# Altium project MicroMultimeter.PrjPCB
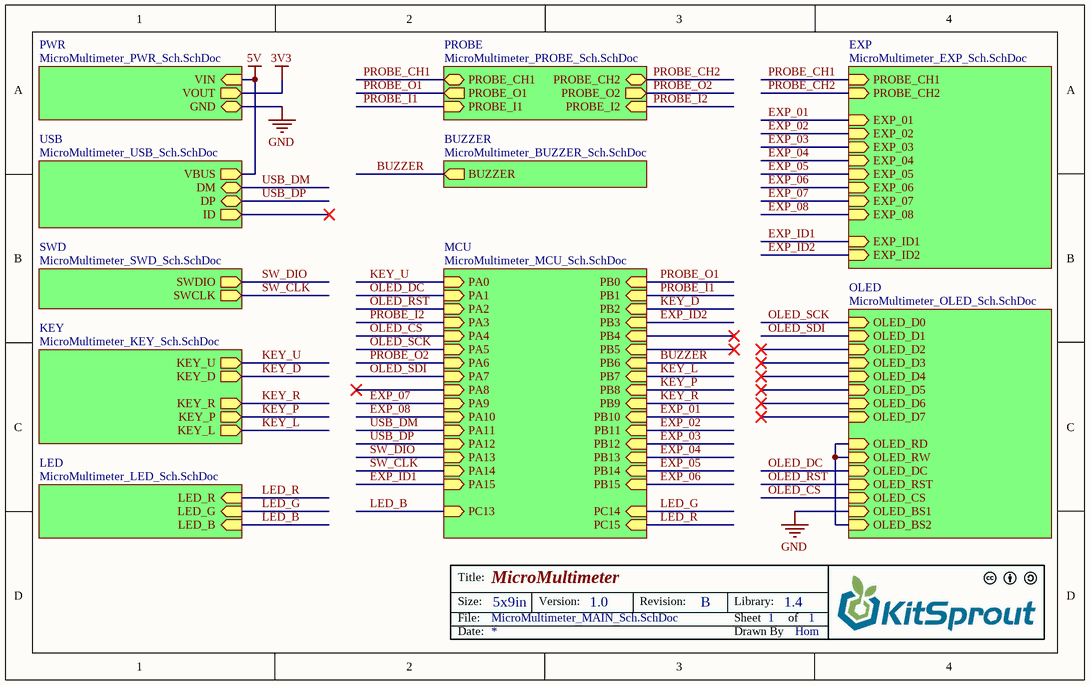
[diagram p0: MicroMultimeter_MAIN_Sch.SchDoc]
11 sheets, 58 parts. Net scope: hierarchical (ports join the sheet entries above them; power ports are global).
Board file: MicroMultimeter__Pcb.PcbDoc
Sheets:
  MicroMultimeter_MAIN_Sch.SchDoc
    PWR = MicroMultimeter_PWR_Sch.SchDoc
    SWD = MicroMultimeter_SWD_Sch.SchDoc
    KEY = MicroMultimeter_KEY_Sch.SchDoc
    USB = MicroMultimeter_USB_Sch.SchDoc
    LED = MicroMultimeter_LED_Sch.SchDoc
    PROBE = MicroMultimeter_PROBE_Sch.SchDoc
    BUZZER = MicroMultimeter_BUZZER_Sch.SchDoc
    OLED = MicroMultimeter_OLED_Sch.SchDoc
    EXP = MicroMultimeter_EXP_Sch.SchDoc
    MCU = MicroMultimeter_MCU_Sch.SchDoc

## Sheet MicroMultimeter_MAIN_Sch.SchDoc: MicroMultimeter
size 203 x 127 mm; Author: Hom; CompanyName: KitSprout; DrawnBy: Hom; Engineer: Hom; Organization: KitSprout; Revision: B; SheetNumber: 1; SheetTotal: 1; License: CC BY-SA 4.0; Version: 1.0; LibVersion: 1.4; PageSetup: Record=PageOptions|CenterHorizontal=True|CenterVertical=True|PrintScale=1.00|XCorrection=1.00|YCorrection=1.00|PrintKind=0|BorderSize=5000000|LeftOffset=0|BottomOffset=0|Orientation=2|PaperLength=1000|PaperWidth=1000|Scale=100|PaperSource=7|PrintQuality=-3|MediaType=1|DitherType=10|PrintScaleMode=0|PaperKind=A4|PaperIndex=9

### Sub-sheets
BUZZER = MicroMultimeter_BUZZER_Sch.SchDoc: BUZZER (out)
EXP = MicroMultimeter_EXP_Sch.SchDoc: PROBE_CH1 (in), PROBE_CH2 (in), EXP_01 (in), EXP_02 (in), EXP_03 (in), EXP_04 (in), EXP_05 (in), EXP_06 (in), EXP_07 (in), EXP_08 (in), EXP_ID1 (in), EXP_ID2 (in)
KEY = MicroMultimeter_KEY_Sch.SchDoc: KEY_D (out), KEY_U (out), KEY_P (out), KEY_R (out), KEY_L (out)
LED = MicroMultimeter_LED_Sch.SchDoc: LED_G (in), LED_R (in), LED_B (in)
MCU = MicroMultimeter_MCU_Sch.SchDoc: PA0 (in), PA1 (in), PA2 (in), PA3 (in), PA4 (in), PA5 (in), PA6 (in), PA7 (in), PA8 (in), PA9 (in), PA10 (in), PA11 (in), PA12 (in), PA13 (in), PA14 (in), PA15 (in), PB0 (in), PB1 (in), PB2 (in), PB3 (in), PB4 (in), PB5 (in), PB6 (in), PB7 (in), PB8 (in), PB9 (in), PB10 (in), PB11 (in), PB12 (in), PB13 (in), PB14 (in), PB15 (in), PC13 (in), PC14 (in), PC15 (in)
OLED = MicroMultimeter_OLED_Sch.SchDoc: OLED_D0 (in), OLED_D1 (in), OLED_D2 (in), OLED_D3 (in), OLED_D4 (in), OLED_D5 (in), OLED_D6 (in), OLED_D7 (in), OLED_RD (in), OLED_RW (in), OLED_DC (in), OLED_RST (in), OLED_CS (in), OLED_BS1 (in), OLED_BS2 (in)
PROBE = MicroMultimeter_PROBE_Sch.SchDoc: PROBE_CH2 (bidir), PROBE_CH1 (bidir), PROBE_I1 (in), PROBE_I2 (in), PROBE_O1 (out), PROBE_O2 (out)
PWR = MicroMultimeter_PWR_Sch.SchDoc: VOUT (out), VIN (in), GND (bidir)
SWD = MicroMultimeter_SWD_Sch.SchDoc: SWDIO (out), SWCLK (out)
USB = MicroMultimeter_USB_Sch.SchDoc: DM (bidir), VBUS (out), DP (bidir), ID (out)

### Nets
5V: sheet PWR/VIN, sheet USB/VBUS
GND: sheet PWR/GND, sheet OLED/OLED_BS1
BUZZER: sheet BUZZER/BUZZER, sheet MCU/PB6
EXP_01: sheet EXP/EXP_01, sheet MCU/PB10
EXP_02: sheet EXP/EXP_02, sheet MCU/PB11
EXP_03: sheet EXP/EXP_03, sheet MCU/PB12
EXP_04: sheet EXP/EXP_04, sheet MCU/PB13
EXP_05: sheet EXP/EXP_05, sheet MCU/PB14
EXP_06: sheet EXP/EXP_06, sheet MCU/PB15
EXP_07: sheet EXP/EXP_07, sheet MCU/PA9
EXP_08: sheet EXP/EXP_08, sheet MCU/PA10
EXP_ID1: sheet EXP/EXP_ID1, sheet MCU/PA15
EXP_ID2: sheet EXP/EXP_ID2, sheet MCU/PB3
KEY_D: sheet KEY/KEY_D, sheet MCU/PB2
KEY_L: sheet KEY/KEY_L, sheet MCU/PB7
KEY_P: sheet KEY/KEY_P, sheet MCU/PB8
KEY_R: sheet KEY/KEY_R, sheet MCU/PB9
KEY_U: sheet KEY/KEY_U, sheet MCU/PA0
LED_B: sheet LED/LED_B, sheet MCU/PC13
LED_G: sheet LED/LED_G, sheet MCU/PC14
LED_R: sheet LED/LED_R, sheet MCU/PC15
OLED_CS: sheet OLED/OLED_CS, sheet MCU/PA4
OLED_DC: sheet OLED/OLED_DC, sheet MCU/PA1
OLED_RST: sheet OLED/OLED_RST, sheet MCU/PA2
OLED_SCK: sheet OLED/OLED_D0, sheet MCU/PA5
OLED_SDI: sheet OLED/OLED_D1, sheet MCU/PA7
PROBE_CH1: sheet PROBE/PROBE_CH1, sheet EXP/PROBE_CH1
PROBE_CH2: sheet PROBE/PROBE_CH2, sheet EXP/PROBE_CH2
PROBE_I1: sheet PROBE/PROBE_I1, sheet MCU/PB1
PROBE_I2: sheet PROBE/PROBE_I2, sheet MCU/PA3
PROBE_O1: sheet PROBE/PROBE_O1, sheet MCU/PB0
PROBE_O2: sheet PROBE/PROBE_O2, sheet MCU/PA6
SW_CLK: sheet SWD/SWCLK, sheet MCU/PA14
SW_DIO: sheet SWD/SWDIO, sheet MCU/PA13
USB_DM: sheet USB/DM, sheet MCU/PA11
USB_DP: sheet USB/DP, sheet MCU/PA12
NetOLED_0.96_11: sheet OLED/OLED_RD, sheet OLED/OLED_RW, sheet OLED/OLED_BS2

### Notes on the sheet
- Title:
- Size:
- Date:
- File:
- 5x9in
- Version:
- Revision:
- Sheet
- Drawn By
- Library:
- of

## Sheet MicroMultimeter_PWR_Sch.SchDoc: MicroMultimeter - PWR
size 127 x 101 mm; Author: Hom; CompanyName: KitSprout; DrawnBy: Hom; Engineer: Hom; Organization: KitSprout; Revision: A; SheetNumber: 1; SheetTotal: 1; License: CC BY-SA 4.0; Version: 1.0; LibVersion: 1.4; PageSetup: Record=PageOptions|CenterHorizontal=True|CenterVertical=True|PrintScale=1.00|XCorrection=1.00|YCorrection=1.00|PrintKind=0|BorderSize=5000000|LeftOffset=0|BottomOffset=0|Orientation=2|PaperLength=1000|PaperWidth=1000|Scale=100|PaperSource=7|PrintQuality=-3|MediaType=1|DitherType=10|PrintScaleMode=0|PaperKind=A4|PaperIndex=9
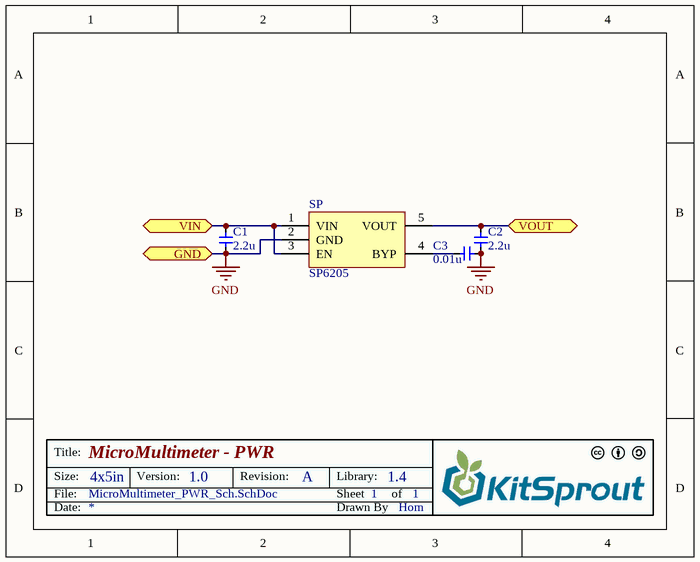
[diagram p1: MicroMultimeter_PWR_Sch.SchDoc]

### Parts
C1  value 2.2u  [CAP_0603]  (hidden comment: Cap_0603)
C2  value 2.2u  [CAP_0603]  (hidden comment: Cap_0603)
C3  value 0.01u  [CAP_0603]  (hidden comment: Cap_0603)
SP  SP6205  [SOT23-5]

### Ports
GND, VIN, VOUT

### Nets
3V3: C2.2 SP.5(VOUT) ; port VOUT
5V: C1.2 SP.1(VIN) SP.3(EN) ; port VIN
GND: C1.1 C2.1 C3.1 SP.2(GND) ; port GND
NetC3_2: C3.2 SP.4(BYP)

### Notes on the sheet
- Title:
- Size:
- Date:
- File:
- 4x5in
- Version:
- Revision:
- Sheet
- Drawn By
- Library:
- of

### Library data of the parts
C1-C3 = Cap_0603: Capacitor
SP = SP6205: Power

## Sheet MicroMultimeter_SWD_Sch.SchDoc: MicroMultimeter - SWD
size 127 x 101 mm; Author: Hom; CompanyName: KitSprout; DrawnBy: Hom; Engineer: Hom; Organization: KitSprout; Revision: A; SheetNumber: 1; SheetTotal: 1; License: CC BY-SA 4.0; Version: 1.0; LibVersion: 1.4; PageSetup: Record=PageOptions|CenterHorizontal=True|CenterVertical=True|PrintScale=1.00|XCorrection=1.00|YCorrection=1.00|PrintKind=0|BorderSize=5000000|LeftOffset=0|BottomOffset=0|Orientation=2|PaperLength=1000|PaperWidth=1000|Scale=100|PaperSource=7|PrintQuality=-3|MediaType=1|DitherType=10|PrintScaleMode=0|PaperKind=A4|PaperIndex=9
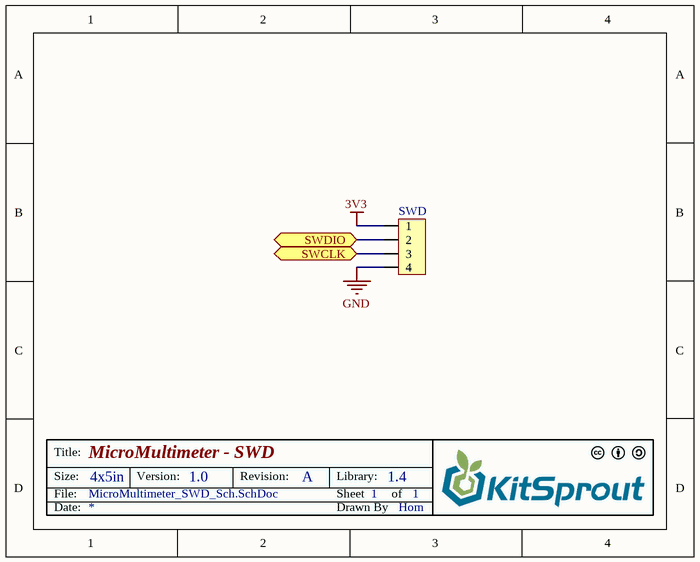
[diagram p2: MicroMultimeter_SWD_Sch.SchDoc]

### Parts
SWD  HDR1x4_1.27  [HDR1X4_1.27_180]  (value not drawn)

### Ports
SWCLK, SWDIO

### Nets
3V3: SWD.1
GND: SWD.4
SW_CLK: SWD.3 ; port SWCLK
SW_DIO: SWD.2 ; port SWDIO

### Notes on the sheet
- Title:
- Size:
- Date:
- File:
- 4x5in
- Version:
- Revision:
- Sheet
- Drawn By
- Library:
- of

### Library data of the parts
SWD = HDR1x4_1.27: Header

## Sheet MicroMultimeter_KEY_Sch.SchDoc: MicroMultimeter - KEY
size 127 x 101 mm; Author: Hom; CompanyName: KitSprout; DrawnBy: Hom; Engineer: Hom; Organization: KitSprout; Revision: A; SheetNumber: 1; SheetTotal: 1; License: CC BY-SA 4.0; Version: 1.0; LibVersion: 1.4; PageSetup: Record=PageOptions|CenterHorizontal=True|CenterVertical=True|PrintScale=1.00|XCorrection=1.00|YCorrection=1.00|PrintKind=0|BorderSize=5000000|LeftOffset=0|BottomOffset=0|Orientation=2|PaperLength=1000|PaperWidth=1000|Scale=100|PaperSource=7|PrintQuality=-3|MediaType=1|DitherType=10|PrintScaleMode=0|PaperKind=A4|PaperIndex=9
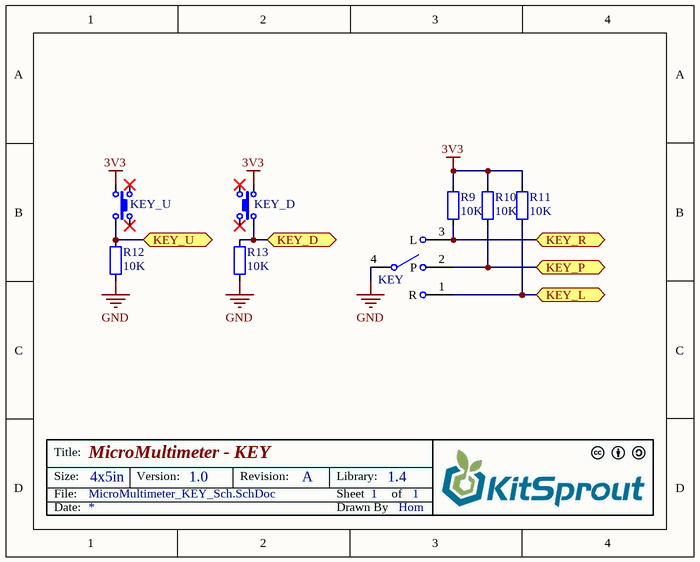
[diagram p3: MicroMultimeter_KEY_Sch.SchDoc]

### Parts
KEY  ButtonPushLever_11*12_90  [ButtonPushLever_11*12_90]  (value not drawn)
KEY_D  ButtonTACT  [ButtonTACT_3.5*3.55_90]  (value not drawn)
KEY_U  ButtonTACT  [ButtonTACT_3.5*3.55_90]  (value not drawn)
R9  value 10K  [RES_0603]  (hidden comment: Res_0603)
R10  value 10K  [RES_0603]  (hidden comment: Res_0603)
R11  value 10K  [RES_0603]  (hidden comment: Res_0603)
R12  value 10K  [RES_0603]  (hidden comment: Res_0603)
R13  value 10K  [RES_0603]  (hidden comment: Res_0603)

### Ports
KEY_D, KEY_L, KEY_P, KEY_R, KEY_U

### Nets
3V3: KEY_D.4 KEY_U.3 R9.2 R10.2 R11.2
GND: KEY.4 R12.1 R13.1
KEY_D: KEY_D.3 R13.2 ; port KEY_D
KEY_L: KEY.1(R) R11.1 ; port KEY_L
KEY_P: KEY.2(P) R10.1 ; port KEY_P
KEY_R: KEY.3(L) R9.1 ; port KEY_R
KEY_U: KEY_U.4 R12.2 ; port KEY_U

Not connected (* = marked no-connect by the designer): KEY_D 1* 2*; KEY_U 1* 2*

### Notes on the sheet
- Title:
- Size:
- Date:
- File:
- 4x5in
- Version:
- Revision:
- Sheet
- Drawn By
- Library:
- of

### Library data of the parts
KEY = ButtonPushLever_11*12_90: Button
KEY_D KEY_U = ButtonTACT: Button
R9-R13 = Res_0603: Resistor

## Sheet MicroMultimeter_USB_Sch.SchDoc: MicroMultimeter - USB
size 127 x 101 mm; Author: Hom; CompanyName: KitSprout; DrawnBy: Hom; Engineer: Hom; Organization: KitSprout; Revision: A; SheetNumber: 1; SheetTotal: 1; License: CC BY-SA 4.0; Version: 1.0; LibVersion: 1.4; PageSetup: Record=PageOptions|CenterHorizontal=True|CenterVertical=True|PrintScale=1.00|XCorrection=1.00|YCorrection=1.00|PrintKind=0|BorderSize=5000000|LeftOffset=0|BottomOffset=0|Orientation=2|PaperLength=1000|PaperWidth=1000|Scale=100|PaperSource=7|PrintQuality=-3|MediaType=1|DitherType=10|PrintScaleMode=0|PaperKind=A4|PaperIndex=9
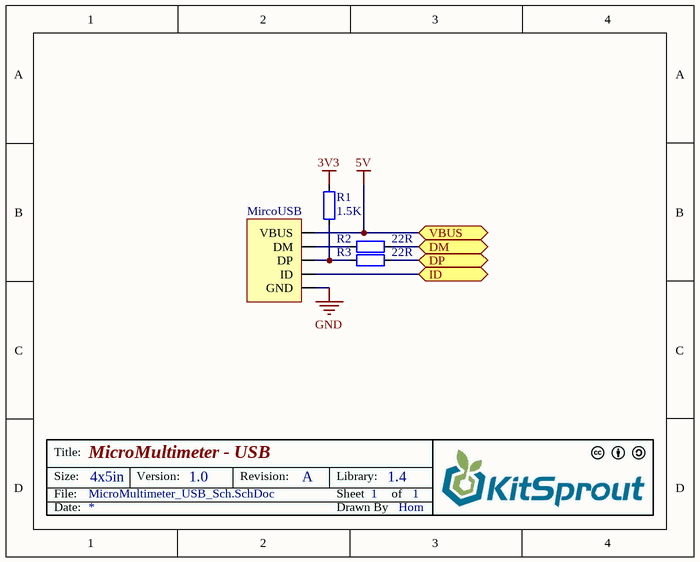
[diagram p4: MicroMultimeter_USB_Sch.SchDoc]

### Parts
MircoUSB  USB_Micro  [USB_Micro-AB]  (value not drawn)
R1  value 1.5K  [RES_0603]  (hidden comment: Res_0603)
R2  value 22R  [RES_0603]  (hidden comment: Res_0603)
R3  value 22R  [RES_0603]  (hidden comment: Res_0603)

### Ports
DM, DP, ID, VBUS

### Nets
3V3: R1.1
5V: MircoUSB.1(VBUS) ; port VBUS
GND: MircoUSB.5(GND)
USB_DM: R2.2 ; port DM
USB_DP: R3.2 ; port DP
NetMircoUSB_2: MircoUSB.2(DM) R2.1
NetMircoUSB_3: MircoUSB.3(DP) R1.2 R3.1
NetMircoUSB_4: MircoUSB.4(ID) ; port ID

### Notes on the sheet
- Title:
- Size:
- Date:
- File:
- 4x5in
- Version:
- Revision:
- Sheet
- Drawn By
- Library:
- of

### Library data of the parts
MircoUSB = USB_Micro: USB
R1-R3 = Res_0603: Resistor

## Sheet MicroMultimeter_LED_Sch.SchDoc: MicroMultimeter - LED
size 127 x 101 mm; Author: Hom; CompanyName: KitSprout; DrawnBy: Hom; Engineer: Hom; Organization: KitSprout; Revision: A; SheetNumber: 1; SheetTotal: 1; License: CC BY-SA 4.0; Version: 1.0; LibVersion: 1.4; PageSetup: Record=PageOptions|CenterHorizontal=True|CenterVertical=True|PrintScale=1.00|XCorrection=1.00|YCorrection=1.00|PrintKind=0|BorderSize=5000000|LeftOffset=0|BottomOffset=0|Orientation=2|PaperLength=1000|PaperWidth=1000|Scale=100|PaperSource=7|PrintQuality=-3|MediaType=1|DitherType=10|PrintScaleMode=0|PaperKind=A4|PaperIndex=9
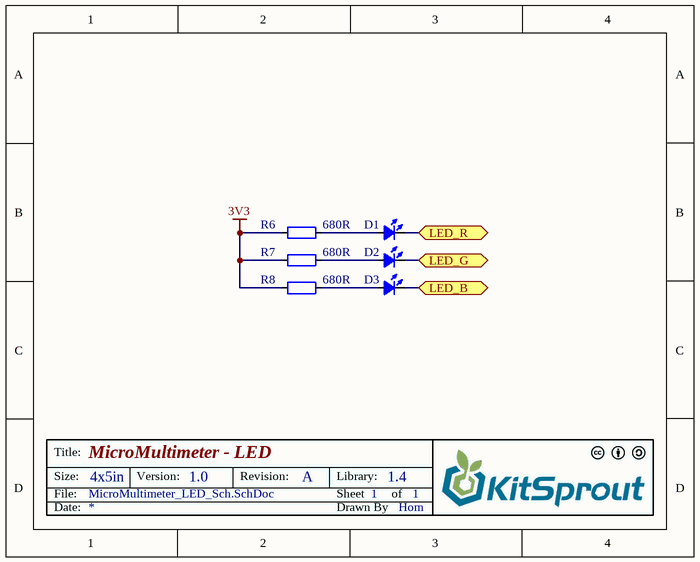
[diagram p5: MicroMultimeter_LED_Sch.SchDoc]

### Parts
D1  LED_0603  [LED_0603_RED]  (value not drawn)
D2  LED_0603  [LED_0603_GREEN]  (value not drawn)
D3  LED_0603  [LED_0603_BLUE]  (value not drawn)
R6  value 680R  [RES_0603]  (hidden comment: Res_0603)
R7  value 680R  [RES_0603]  (hidden comment: Res_0603)
R8  value 680R  [RES_0603]  (hidden comment: Res_0603)

### Ports
LED_B, LED_G, LED_R

### Nets
3V3: R6.2 R7.2 R8.1
LED_B: D3.2(K) ; port LED_B
LED_G: D2.2(K) ; port LED_G
LED_R: D1.2(K) ; port LED_R
NetD1_1: D1.1(A) R6.1
NetD2_1: D2.1(A) R7.1
NetD3_1: D3.1(A) R8.2

### Notes on the sheet
- Title:
- Size:
- Date:
- File:
- 4x5in
- Version:
- Revision:
- Sheet
- Drawn By
- Library:
- of

### Library data of the parts
D1-D3 = LED_0603: LED
R6-R8 = Res_0603: Resistor

## Sheet MicroMultimeter_PROBE_Sch.SchDoc: MicroMultimeter - Probe
size 152 x 101 mm; Author: Hom; CompanyName: KitSprout; DrawnBy: Hom; Engineer: Hom; Organization: KitSprout; Revision: A; SheetNumber: 1; SheetTotal: 1; License: CC BY-SA 4.0; Version: 1.0; LibVersion: 1.4; PageSetup: Record=PageOptions|CenterHorizontal=True|CenterVertical=True|PrintScale=1.00|XCorrection=1.00|YCorrection=1.00|PrintKind=0|BorderSize=5000000|LeftOffset=0|BottomOffset=0|Orientation=2|PaperLength=1000|PaperWidth=1000|Scale=100|PaperSource=7|PrintQuality=-3|MediaType=1|DitherType=10|PrintScaleMode=0|PaperKind=A4|PaperIndex=9
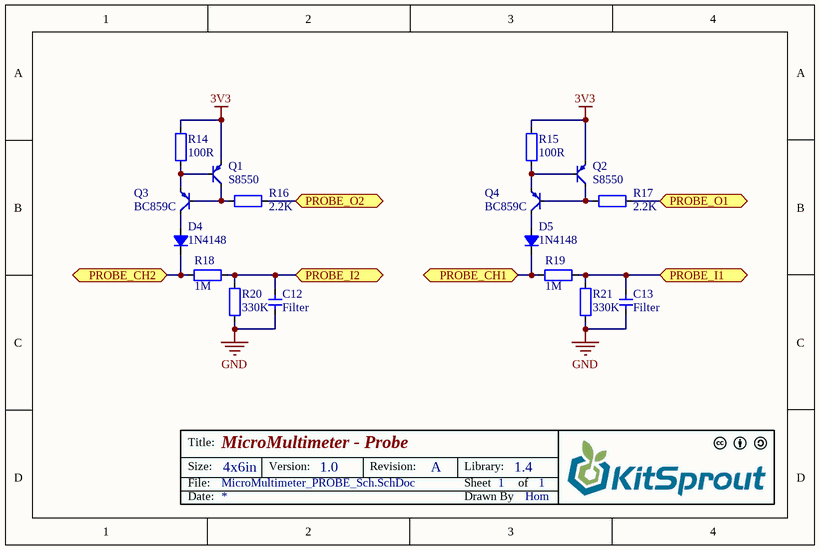
[diagram p6: MicroMultimeter_PROBE_Sch.SchDoc]

### Parts
C12  value Filter  [CAP_0603]  (hidden comment: Cap_0603)
C13  value Filter  [CAP_0603]  (hidden comment: Cap_0603)
D4  value 1N4148  [SOD323]  (hidden comment: Diode_SOD323)
D5  value 1N4148  [SOD323]  (hidden comment: Diode_SOD323)
Q1  value S8550  [SOT23-3]  (hidden comment: BJT_PNP)
Q2  value S8550  [SOT23-3]  (hidden comment: BJT_PNP)
Q3  value BC859C  [SOT23-3]  (hidden comment: BJT_PNP)
Q4  value BC859C  [SOT23-3]  (hidden comment: BJT_PNP)
R14  value 100R  [RES_0603]  (hidden comment: Res_0603)
R15  value 100R  [RES_0603]  (hidden comment: Res_0603)
R16  value 2.2K  [RES_0603]  (hidden comment: Res_0603)
R17  value 2.2K  [RES_0603]  (hidden comment: Res_0603)
R18  value 1M  [RES_0603]  (hidden comment: Res_0603)
R19  value 1M  [RES_0603]  (hidden comment: Res_0603)
R20  value 330K  [RES_0603]  (hidden comment: Res_0603)
R21  value 330K  [RES_0603]  (hidden comment: Res_0603)

### Ports
PROBE_CH1, PROBE_CH2 (bidir), PROBE_I1, PROBE_I2, PROBE_O1, PROBE_O2

### Nets
3V3: Q1.2(E) Q2.2(E) R14.2 R15.2
GND: C12.1 C13.1 R20.1 R21.1
PROBE_CH1: D5.2(K) R19.2 ; port PROBE_CH1
PROBE_CH2: D4.2(K) R18.2 ; port PROBE_CH2
PROBE_I1: C13.2 R19.1 R21.2 ; port PROBE_I1
PROBE_I2: C12.2 R18.1 R20.2 ; port PROBE_I2
PROBE_O1: R17.1 ; port PROBE_O1
PROBE_O2: R16.1 ; port PROBE_O2
NetD4_1: D4.1(A) Q3.3(C)
NetD5_1: D5.1(A) Q4.3(C)
NetQ1_1: Q1.1(B) Q3.2(E) R14.1
NetQ1_3: Q1.3(C) Q3.1(B) R16.2
NetQ2_1: Q2.1(B) Q4.2(E) R15.1
NetQ2_3: Q2.3(C) Q4.1(B) R17.2

### Notes on the sheet
- Title:
- Size:
- Date:
- File:
- 4x6in
- Version:
- Revision:
- Sheet
- Drawn By
- Library:
- of

### Library data of the parts
C12 C13 = Cap_0603: Capacitor
D4 D5 = Diode_SOD323: Diode
Q1-Q4 = BJT_PNP: Transistor
R14-R21 = Res_0603: Resistor

## Sheet MicroMultimeter_BUZZER_Sch.SchDoc: MicroMultimeter - Buzzer
size 127 x 101 mm; Author: Hom; CompanyName: KitSprout; DrawnBy: Hom; Engineer: Hom; Organization: KitSprout; Revision: A; SheetNumber: 1; SheetTotal: 1; License: CC BY-SA 4.0; Version: 1.0; LibVersion: 1.4; PageSetup: Record=PageOptions|CenterHorizontal=True|CenterVertical=True|PrintScale=1.00|XCorrection=1.00|YCorrection=1.00|PrintKind=0|BorderSize=5000000|LeftOffset=0|BottomOffset=0|Orientation=2|PaperLength=1000|PaperWidth=1000|Scale=100|PaperSource=7|PrintQuality=-3|MediaType=1|DitherType=10|PrintScaleMode=0|PaperKind=A4|PaperIndex=9
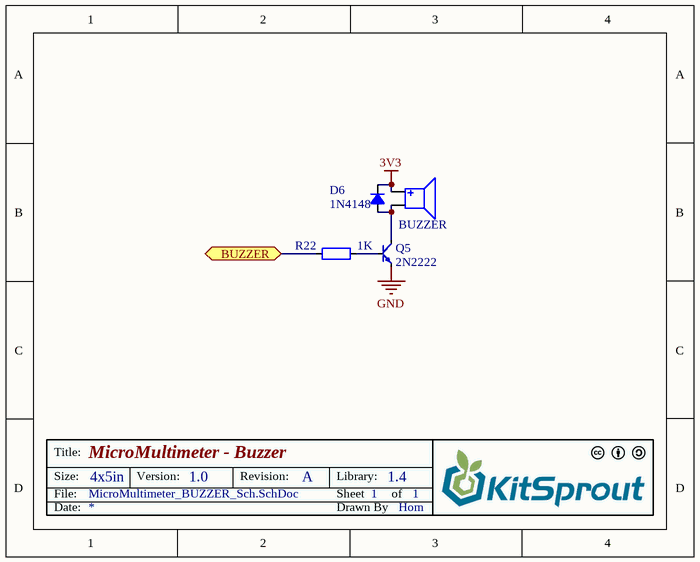
[diagram p7: MicroMultimeter_BUZZER_Sch.SchDoc]

### Parts
BUZZER  Buzzer  [Buzzer_5x5]  (value not drawn)
D6  value 1N4148  [SOD323]  (hidden comment: Diode_SOD323)
Q5  value 2N2222  [SOT23-3]  (hidden comment: BJT_NPN)
R22  value 1K  [RES_0603]  (hidden comment: Res_0603)

### Ports
BUZZER

### Nets
3V3: BUZZER.P(Positive) D6.2(K)
GND: Q5.2(E)
BUZZER: R22.2 ; port BUZZER
NetBUZZER_N: BUZZER.N(Negative) D6.1(A) Q5.3(C)
NetQ5_1: Q5.1(B) R22.1

### Notes on the sheet
- Title:
- Size:
- Date:
- File:
- 4x5in
- Version:
- Revision:
- Sheet
- Drawn By
- Library:
- of

### Library data of the parts
D6 = Diode_SOD323: Diode
Q5 = BJT_NPN: Transistor
R22 = Res_0603: Resistor

## Sheet MicroMultimeter_OLED_Sch.SchDoc: MicroMultimeter - OLED
size 127 x 101 mm; Author: Hom; CompanyName: KitSprout; DrawnBy: Hom; Engineer: Hom; Organization: KitSprout; Revision: A; SheetNumber: 1; SheetTotal: 1; License: CC BY-SA 4.0; Version: 1.0; LibVersion: 1.4; PageSetup: Record=PageOptions|CenterHorizontal=True|CenterVertical=True|PrintScale=1.00|XCorrection=1.00|YCorrection=1.00|PrintKind=0|BorderSize=5000000|LeftOffset=0|BottomOffset=0|Orientation=2|PaperLength=1000|PaperWidth=1000|Scale=100|PaperSource=7|PrintQuality=-3|MediaType=1|DitherType=10|PrintScaleMode=0|PaperKind=A4|PaperIndex=9
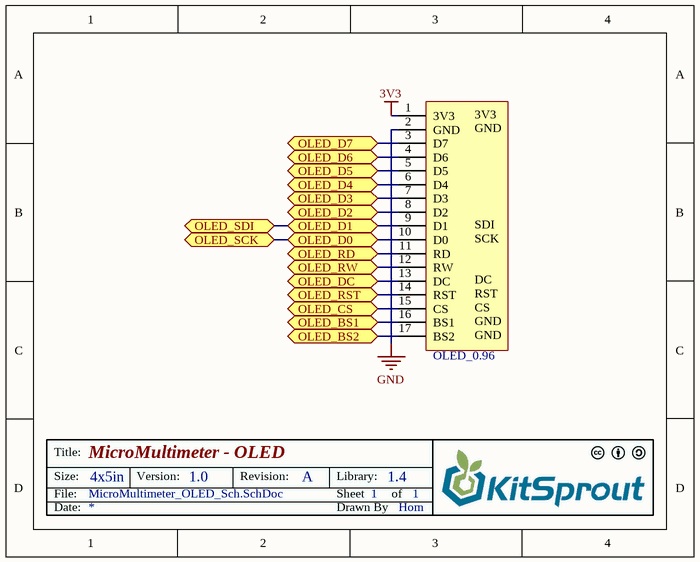
[diagram p8: MicroMultimeter_OLED_Sch.SchDoc]

### Parts
OLED_0.96  OLED_0.96  [OLED_0.96_96x64]  (value not drawn)

### Ports
OLED_BS1, OLED_BS2, OLED_CS, OLED_D0, OLED_D1, OLED_D2, OLED_D3, OLED_D4, OLED_D5, OLED_D6, OLED_D7, OLED_DC, OLED_RD, OLED_RST, OLED_RW, OLED_SCK, OLED_SDI

### Nets
3V3: OLED_0.96.1(3V3)
GND: OLED_0.96.2(GND) OLED_0.96.16(BS1) ; port OLED_BS1
OLED_CS: OLED_0.96.15(CS) ; port OLED_CS
OLED_DC: OLED_0.96.13(DC) ; port OLED_DC
OLED_RST: OLED_0.96.14(RST) ; port OLED_RST
OLED_SCK: OLED_0.96.10(D0) ; port OLED_D0, port OLED_SCK
OLED_SDI: OLED_0.96.9(D1) ; port OLED_D1, port OLED_SDI
NetOLED_0.96_3: OLED_0.96.3(D7) ; port OLED_D7
NetOLED_0.96_4: OLED_0.96.4(D6) ; port OLED_D6
NetOLED_0.96_5: OLED_0.96.5(D5) ; port OLED_D5
NetOLED_0.96_6: OLED_0.96.6(D4) ; port OLED_D4
NetOLED_0.96_7: OLED_0.96.7(D3) ; port OLED_D3
NetOLED_0.96_8: OLED_0.96.8(D2) ; port OLED_D2
NetOLED_0.96_11: OLED_0.96.11(RD) OLED_0.96.12(RW) OLED_0.96.17(BS2) ; port OLED_RD, port OLED_RW, port OLED_BS2

### Notes on the sheet
- Title:
- Size:
- Date:
- File:
- 4x5in
- Version:
- Revision:
- Sheet
- Drawn By
- Library:
- of
- (in symbol OLED_0.96_96*64) SDI; SCK

### Library data of the parts
OLED_0.96 = OLED_0.96_96*64: Module

## Sheet MicroMultimeter_EXP_Sch.SchDoc: MicroMultimeter - EXP
size 127 x 101 mm; Author: Hom; CompanyName: KitSprout; DrawnBy: Hom; Engineer: Hom; Organization: KitSprout; Revision: A; SheetNumber: 1; SheetTotal: 1; License: CC BY-SA 4.0; Version: 1.0; LibVersion: 1.4; PageSetup: Record=PageOptions|CenterHorizontal=True|CenterVertical=True|PrintScale=1.00|XCorrection=1.00|YCorrection=1.00|PrintKind=0|BorderSize=5000000|LeftOffset=0|BottomOffset=0|Orientation=2|PaperLength=1000|PaperWidth=1000|Scale=100|PaperSource=7|PrintQuality=-3|MediaType=1|DitherType=10|PrintScaleMode=0|PaperKind=A4|PaperIndex=9
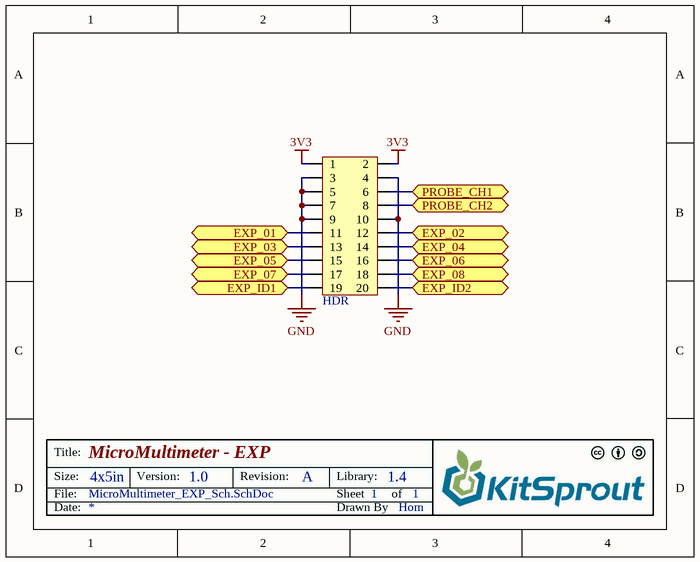
[diagram p9: MicroMultimeter_EXP_Sch.SchDoc]

### Parts
HDR  HDR2x10_2.54  [HDR2X10_2.54_180HF]  (value not drawn)

### Ports
EXP_01, EXP_02, EXP_03, EXP_04, EXP_05, EXP_06, EXP_07, EXP_08, EXP_ID1, EXP_ID2, PROBE_CH1, PROBE_CH2

### Nets
3V3: HDR.1 HDR.2
GND: HDR.3 HDR.4 HDR.5 HDR.7 HDR.9 HDR.10
EXP_01: HDR.11 ; port EXP_01
EXP_02: HDR.12 ; port EXP_02
EXP_03: HDR.13 ; port EXP_03
EXP_04: HDR.14 ; port EXP_04
EXP_05: HDR.15 ; port EXP_05
EXP_06: HDR.16 ; port EXP_06
EXP_07: HDR.17 ; port EXP_07
EXP_08: HDR.18 ; port EXP_08
EXP_ID1: HDR.19 ; port EXP_ID1
EXP_ID2: HDR.20 ; port EXP_ID2
PROBE_CH1: HDR.6 ; port PROBE_CH1
PROBE_CH2: HDR.8 ; port PROBE_CH2

### Notes on the sheet
- Title:
- Size:
- Date:
- File:
- 4x5in
- Version:
- Revision:
- Sheet
- Drawn By
- Library:
- of

### Library data of the parts
HDR = HDR2x10_2.54: Header

## Sheet MicroMultimeter_MCU_Sch.SchDoc: MicroMultimeter - MCU
size 127 x 127 mm; Author: Hom; CompanyName: KitSprout; DrawnBy: Hom; Engineer: Hom; Organization: KitSprout; Revision: A; SheetNumber: 1; SheetTotal: 1; License: CC BY-SA 4.0; Version: 1.0; LibVersion: 1.4; PageSetup: Record=PageOptions|CenterHorizontal=True|CenterVertical=True|PrintScale=1.00|XCorrection=1.00|YCorrection=1.00|PrintKind=0|BorderSize=5000000|LeftOffset=0|BottomOffset=0|Orientation=2|PaperLength=1000|PaperWidth=1000|Scale=100|PaperSource=7|PrintQuality=-3|MediaType=1|DitherType=10|PrintScaleMode=0|PaperKind=A4|PaperIndex=9
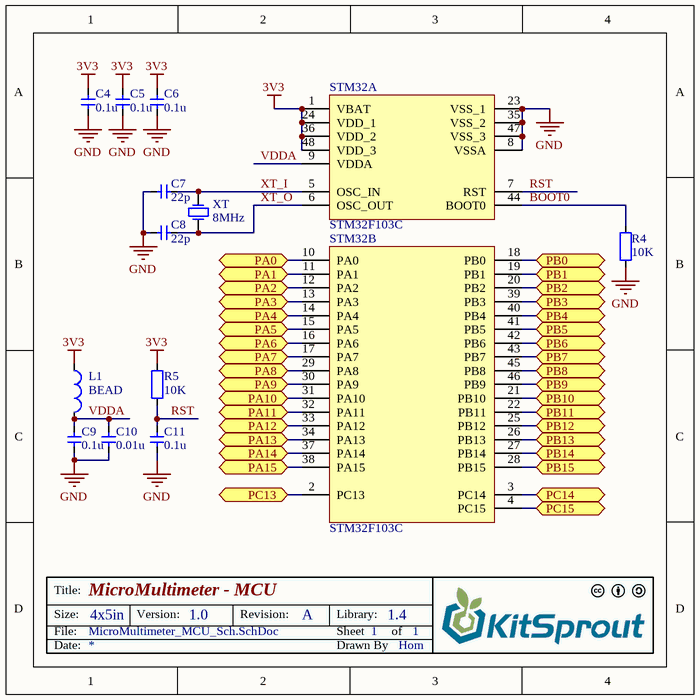
[diagram p10: MicroMultimeter_MCU_Sch.SchDoc]

### Parts
C4  value 0.1u  [CAP_0603]  (hidden comment: Cap_0603)
C5  value 0.1u  [CAP_0603]  (hidden comment: Cap_0603)
C6  value 0.1u  [CAP_0603]  (hidden comment: Cap_0603)
C7  value 22p  [CAP_0603]  (hidden comment: Cap_0603)
C8  value 22p  [CAP_0603]  (hidden comment: Cap_0603)
C9  value 0.1u  [CAP_0603]  (hidden comment: Cap_0603)
C10  value 0.01u  [CAP_0603]  (hidden comment: Cap_0603)
C11  value 0.1u  [CAP_0603]  (hidden comment: Cap_0603)
L1  value BEAD  [IND_0603]  (hidden comment: Ind_0603)
R4  value 10K  [RES_0603]  (hidden comment: Res_0603)
R5  value 10K  [RES_0603]  (hidden comment: Res_0603)
STM32  STM32F103C  [LQFP_P0.5_48]  (parts A,B of 2)
XT  value 8MHz  [XT_5032_2]  (hidden comment: XTAL_5032_2P)

### Ports
PA0, PA1, PA2, PA3, PA4, PA5, PA6, PA7, PA8, PA9, PA10, PA11, PA12, PA13, PA14, PA15, PB0, PB1, PB2, PB3, PB4, PB5, PB6, PB7, PB8, PB9, PB10, PB11, PB12, PB13, PB14, PB15, PC13, PC14, PC15

### Nets
3V3: C4.2 C5.2 C6.2 L1.1 R5.2 STM32.1(VBAT) STM32.24(VDD_1) STM32.36(VDD_2) STM32.48(VDD_3)
GND: C4.1 C5.1 C6.1 C7.2 C8.2 C9.1 C10.1 C11.1 R4.1 STM32.8(VSSA) STM32.23(VSS_1) STM32.35(VSS_2) STM32.47(VSS_3)
BOOT0: R4.2 STM32.44(BOOT0)
BUZZER: STM32.42(PB6) ; port PB6
EXP_01: STM32.21(PB10) ; port PB10
EXP_02: STM32.22(PB11) ; port PB11
EXP_03: STM32.25(PB12) ; port PB12
EXP_04: STM32.26(PB13) ; port PB13
EXP_05: STM32.27(PB14) ; port PB14
EXP_06: STM32.28(PB15) ; port PB15
EXP_07: STM32.30(PA9) ; port PA9
EXP_08: STM32.31(PA10) ; port PA10
EXP_ID1: STM32.38(PA15) ; port PA15
EXP_ID2: STM32.39(PB3) ; port PB3
KEY_D: STM32.20(PB2) ; port PB2
KEY_L: STM32.43(PB7) ; port PB7
KEY_P: STM32.45(PB8) ; port PB8
KEY_R: STM32.46(PB9) ; port PB9
KEY_U: STM32.10(PA0) ; port PA0
LED_B: STM32.2(PC13) ; port PC13
LED_G: STM32.3(PC14) ; port PC14
LED_R: STM32.4(PC15) ; port PC15
OLED_CS: STM32.14(PA4) ; port PA4
OLED_DC: STM32.11(PA1) ; port PA1
OLED_RST: STM32.12(PA2) ; port PA2
OLED_SCK: STM32.15(PA5) ; port PA5
OLED_SDI: STM32.17(PA7) ; port PA7
PROBE_I1: STM32.19(PB1) ; port PB1
PROBE_I2: STM32.13(PA3) ; port PA3
PROBE_O1: STM32.18(PB0) ; port PB0
PROBE_O2: STM32.16(PA6) ; port PA6
RST: C11.2 R5.1 STM32.7(RST)
SW_CLK: STM32.37(PA14) ; port PA14
SW_DIO: STM32.34(PA13) ; port PA13
USB_DM: STM32.32(PA11) ; port PA11
USB_DP: STM32.33(PA12) ; port PA12
VDDA: C9.2 C10.2 L1.2 STM32.9(VDDA)
XT_I: C7.1 STM32.5(OSC_IN) XT.2(OSC2)
XT_O: C8.1 STM32.6(OSC_OUT) XT.1(OSC1)
NetSTM32_29: STM32.29(PA8) ; port PA8
NetSTM32_40: STM32.40(PB4) ; port PB4
NetSTM32_41: STM32.41(PB5) ; port PB5

### Notes on the sheet
- Title:
- Size:
- Date:
- File:
- 4x5in
- Version:
- Revision:
- Sheet
- Drawn By
- Library:
- of

### Library data of the parts
C4-C11 = Cap_0603: Capacitor
L1 = Ind_0603: Inductor
R4 R5 = Res_0603: Resistor
STM32 = STM32F103C: MCU
XT = XTAL_5032_2P: Crystal Oscillator

## Nets that join several sheets
3V3: MicroMultimeter_PWR_Sch (C2.2 SP.5), MicroMultimeter_SWD_Sch (SWD.1), MicroMultimeter_KEY_Sch (5 pins), MicroMultimeter_USB_Sch (R1.1), MicroMultimeter_LED_Sch (R6.2 R7.2 R8.1), MicroMultimeter_PROBE_Sch (Q1.2 Q2.2 R14.2 R15.2), MicroMultimeter_BUZZER_Sch (BUZZER.P D6.2), MicroMultimeter_OLED_Sch (OLED_0.96.1), MicroMultimeter_EXP_Sch (HDR.1 HDR.2), MicroMultimeter_MCU_Sch (9 pins)
5V: MicroMultimeter_PWR_Sch (C1.2 SP.1 SP.3), MicroMultimeter_USB_Sch (MircoUSB.1)
GND: MicroMultimeter_PWR_Sch (C1.1 C2.1 C3.1 SP.2), MicroMultimeter_SWD_Sch (SWD.4), MicroMultimeter_KEY_Sch (KEY.4 R12.1 R13.1), MicroMultimeter_USB_Sch (MircoUSB.5), MicroMultimeter_PROBE_Sch (C12.1 C13.1 R20.1 R21.1), MicroMultimeter_BUZZER_Sch (Q5.2), MicroMultimeter_OLED_Sch (OLED_0.96.2 OLED_0.96.16), MicroMultimeter_EXP_Sch (6 pins), MicroMultimeter_MCU_Sch (13 pins)
BUZZER: MicroMultimeter_BUZZER_Sch (R22.2), MicroMultimeter_MCU_Sch (STM32.42)
EXP_01: MicroMultimeter_EXP_Sch (HDR.11), MicroMultimeter_MCU_Sch (STM32.21)
EXP_02: MicroMultimeter_EXP_Sch (HDR.12), MicroMultimeter_MCU_Sch (STM32.22)
EXP_03: MicroMultimeter_EXP_Sch (HDR.13), MicroMultimeter_MCU_Sch (STM32.25)
EXP_04: MicroMultimeter_EXP_Sch (HDR.14), MicroMultimeter_MCU_Sch (STM32.26)
EXP_05: MicroMultimeter_EXP_Sch (HDR.15), MicroMultimeter_MCU_Sch (STM32.27)
EXP_06: MicroMultimeter_EXP_Sch (HDR.16), MicroMultimeter_MCU_Sch (STM32.28)
EXP_07: MicroMultimeter_EXP_Sch (HDR.17), MicroMultimeter_MCU_Sch (STM32.30)
EXP_08: MicroMultimeter_EXP_Sch (HDR.18), MicroMultimeter_MCU_Sch (STM32.31)
EXP_ID1: MicroMultimeter_EXP_Sch (HDR.19), MicroMultimeter_MCU_Sch (STM32.38)
EXP_ID2: MicroMultimeter_EXP_Sch (HDR.20), MicroMultimeter_MCU_Sch (STM32.39)
KEY_D: MicroMultimeter_KEY_Sch (KEY_D.3 R13.2), MicroMultimeter_MCU_Sch (STM32.20)
KEY_L: MicroMultimeter_KEY_Sch (KEY.1 R11.1), MicroMultimeter_MCU_Sch (STM32.43)
KEY_P: MicroMultimeter_KEY_Sch (KEY.2 R10.1), MicroMultimeter_MCU_Sch (STM32.45)
KEY_R: MicroMultimeter_KEY_Sch (KEY.3 R9.1), MicroMultimeter_MCU_Sch (STM32.46)
KEY_U: MicroMultimeter_KEY_Sch (KEY_U.4 R12.2), MicroMultimeter_MCU_Sch (STM32.10)
LED_B: MicroMultimeter_LED_Sch (D3.2), MicroMultimeter_MCU_Sch (STM32.2)
LED_G: MicroMultimeter_LED_Sch (D2.2), MicroMultimeter_MCU_Sch (STM32.3)
LED_R: MicroMultimeter_LED_Sch (D1.2), MicroMultimeter_MCU_Sch (STM32.4)
OLED_CS: MicroMultimeter_OLED_Sch (OLED_0.96.15), MicroMultimeter_MCU_Sch (STM32.14)
OLED_DC: MicroMultimeter_OLED_Sch (OLED_0.96.13), MicroMultimeter_MCU_Sch (STM32.11)
OLED_RST: MicroMultimeter_OLED_Sch (OLED_0.96.14), MicroMultimeter_MCU_Sch (STM32.12)
OLED_SCK: MicroMultimeter_OLED_Sch (OLED_0.96.10), MicroMultimeter_MCU_Sch (STM32.15)
OLED_SDI: MicroMultimeter_OLED_Sch (OLED_0.96.9), MicroMultimeter_MCU_Sch (STM32.17)
PROBE_CH1: MicroMultimeter_PROBE_Sch (D5.2 R19.2), MicroMultimeter_EXP_Sch (HDR.6)
PROBE_CH2: MicroMultimeter_PROBE_Sch (D4.2 R18.2), MicroMultimeter_EXP_Sch (HDR.8)
PROBE_I1: MicroMultimeter_PROBE_Sch (C13.2 R19.1 R21.2), MicroMultimeter_MCU_Sch (STM32.19)
PROBE_I2: MicroMultimeter_PROBE_Sch (C12.2 R18.1 R20.2), MicroMultimeter_MCU_Sch (STM32.13)
PROBE_O1: MicroMultimeter_PROBE_Sch (R17.1), MicroMultimeter_MCU_Sch (STM32.18)
PROBE_O2: MicroMultimeter_PROBE_Sch (R16.1), MicroMultimeter_MCU_Sch (STM32.16)
SW_CLK: MicroMultimeter_SWD_Sch (SWD.3), MicroMultimeter_MCU_Sch (STM32.37)
SW_DIO: MicroMultimeter_SWD_Sch (SWD.2), MicroMultimeter_MCU_Sch (STM32.34)
USB_DM: MicroMultimeter_USB_Sch (R2.2), MicroMultimeter_MCU_Sch (STM32.32)
USB_DP: MicroMultimeter_USB_Sch (R3.2), MicroMultimeter_MCU_Sch (STM32.33)